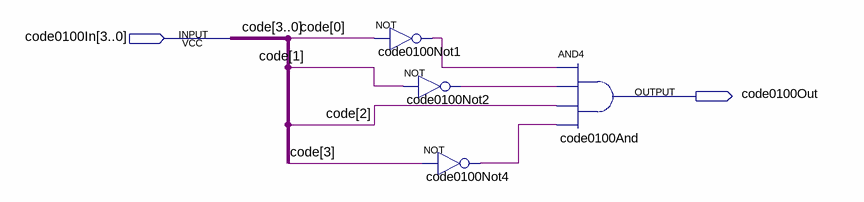
[diagram p0: schematic sheet]
// Quartus schematic code0100.bdf as structural Verilog: 4 symbols, 2 pins
module code0100 (
  input  [3:0] code0100In,
  output code0100Out
);

  wire code0100Not1_out, code0100Not2_out, code0100Not4_out;

  not code0100Not1 (code0100Not1_out, code0100In[0]);
  not code0100Not2 (code0100Not2_out, code0100In[1]);
  not code0100Not4 (code0100Not4_out, code0100In[3]);
  and code0100And (code0100Out, code0100Not1_out, code0100Not2_out, code0100In[2], code0100Not4_out);

  // Other names for the same wires on the sheet: code[3:0] = code0100In
endmodule
